# EAGLE schematic schematic (EAGLE 7.3.0)
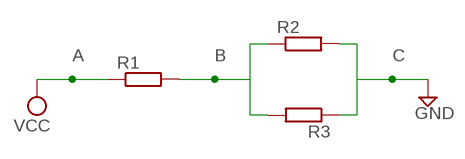
[diagram p0: schematic, sheet 1]

## Parts
R1  R-EU_0207/10  [0207/10]
R2  R-EU_0207/10  [0207/10]
R3  R-EU_0207/10  [0207/10]

## Nets
A: R1.1 ; supply symbol labelled VCC
B: R1.2 R2.1 R3.2
C: R2.2 R3.1 ; supply symbol labelled GND

## Library data of the parts
R1-R3 = rcl:R-EU_: RESISTOR, European symbol